# Altium schematic sheet ftdi232h.SchDoc: USB Interface
size A; Organization: UCLA HEP; DocumentNumber: 6; Revision: 2.0; SheetNumber: 6; SheetTotal: 14
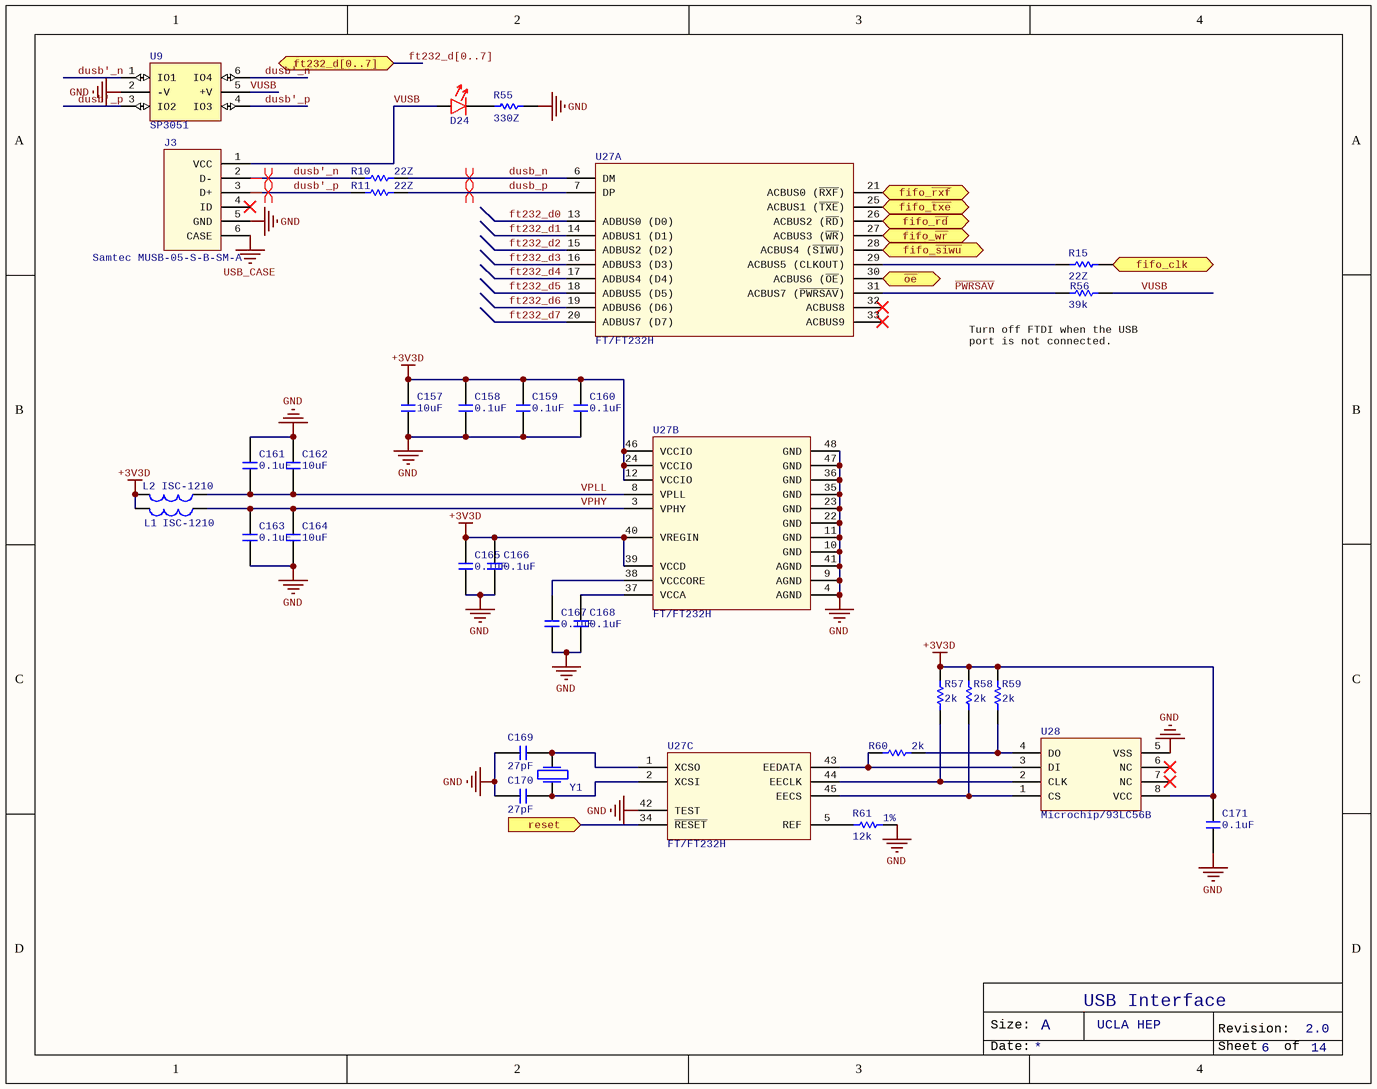
[diagram p0: ftdi232h.SchDoc]

## Parts
C157  10uF  [c1206]
C158  0.1uF  [C0402]
C159  0.1uF  [C0402]
C160  0.1uF  [C0402]
C161  0.1uF  [C0402]
C162  10uF  [c1206]
C163  0.1uF  [C0402]
C164  10uF  [c1206]
C165  0.1uF  [C0402]
C166  0.1uF  [C0402]
C167  0.1uF  [C0402]
C168  0.1uF  [C0402]
C169  27pF  [C0402]
C170  27pF  [C0402]
C171  0.1uF  [C0402]
D24  LITEON/LTST-C171KRKT  [LED0805]  (value not drawn)
J3  Samtec MUSB-05-S-B-SM-A  [MUSB-05-S-B-SM-A]
L1  ISC-1210  [ISC-1210]
L2  ISC-1210  [ISC-1210]
R10  22Z  [R0402]
R11  22Z  [R0402]
R15  22Z  [R0603]
R55  330Z  [R0603]
R56  39k  [R0603]
R57  2k  [R0603]
R58  2k  [R0603]
R59  2k  [R0603]
R60  2k  [R0603]
R61  12k  [R0603]
U9  SP3051  [SOT23-6]
U27  FT/FT232H  [LQFP-48]  (parts A,B,C of 3)
U28  Microchip/93LC56B  [SOIC-8]
Y1  XTAL  [XTAL]  (value not drawn)

## Ports
fifo_clk (in), fifo_~{rd} (in), fifo_~{rxf} (out), fifo_~{siwu} (in), fifo_~{txe} (out), fifo_~{wr} (in), ft232_d[0..7] (bidir), reset (in), ~{oe} (in)

## Nets
+3V3D: C157.2 C158.2 C159.2 C160.2 C165.2 C166.2 C171.2 L1.1 L2.1 R57.2 R58.2 R59.2 U27.12(VCCIO) U27.24(VCCIO) U27.39(VCCD) U27.40(VREGIN) U27.46(VCCIO) U28.8(VCC)
GND: C157.1 C158.1 C159.1 C160.1 C161.2 C162.2 C163.1 C164.2 C165.1 C166.1 C167.1 C168.1 C169.2 C170.2 C171.1 J3.5(GND) R55.1 R61.2 U9.2(-V) U27.4(AGND) U27.9(AGND) U27.10(GND) U27.11(GND) U27.22(GND) U27.23(GND) U27.35(GND) U27.36(GND) U27.41(AGND) U27.42(TEST) U27.47(GND) U27.48(GND) U28.5(VSS)
USB_CASE: J3.6(CASE)
dusb'_n: J3.2(D-) R10.1 U9.1(IO1) U9.6(IO4)
dusb'_p: J3.3(D+) R11.1 U9.3(IO2) U9.4(IO3)
dusb_n: R10.2 U27.6(DM)
dusb_p: R11.2 U27.7(DP)
fifo_clk: R15.2 ; port fifo_clk
fifo_~{rd}: U27.26(ACBUS2_(~{RD})) ; port fifo_~{rd}
fifo_~{rxf}: U27.21(ACBUS0_(~{RXF})) ; port fifo_~{rxf}
fifo_~{siwu}: U27.28(ACBUS4_(~{SIWU})) ; port fifo_~{siwu}
fifo_~{txe}: U27.25(ACBUS1_(~{TXE})) ; port fifo_~{txe}
fifo_~{wr}: U27.27(ACBUS3_(~{WR})) ; port fifo_~{wr}
ft232_d0: U27.13(ADBUS0_(D0))
ft232_d1: U27.14(ADBUS1_(D1))
ft232_d2: U27.15(ADBUS2_(D2))
ft232_d3: U27.16(ADBUS3_(D3))
ft232_d4: U27.17(ADBUS4_(D4))
ft232_d5: U27.18(ADBUS5_(D5))
ft232_d6: U27.19(ADBUS6_(D6))
ft232_d7: U27.20(ADBUS7_(D7))
~{oe}: U27.30(ACBUS6_(~{OE})) ; port ~{oe}
~{PWRSAV}: R56.1 U27.31(ACBUS7_(~{PWRSAV}))
reset: U27.34(~{RESET}) ; port reset
VPHY: C163.2 C164.1 L1.2 U27.3(VPHY)
VPLL: C161.1 C162.1 L2.2 U27.8(VPLL)
VUSB: D24.A J3.1(VCC) R56.2 U9.5(+V)
NetC167_2: C167.2 U27.38(VCCCORE)
NetC168_2: C168.2 U27.37(VCCA)
NetC169_1: C169.1 U27.1(XCSO) Y1.2
NetC170_1: C170.1 U27.2(XCSI) Y1.1
NetD24_C: D24.C R55.2
NetR15_1: R15.1 U27.29(ACBUS5_(CLKOUT))
NetR57_1: R57.1 U27.44(EECLK) U28.2(CLK)
NetR58_1: R58.1 U27.45(EECS) U28.1(CS)
NetR59_1: R59.1 R60.2 U28.4(DO)
NetR60_1: R60.1 U27.43(EEDATA) U28.3(DI)
NetR61_1: R61.1 U27.5(REF)

Not connected (* = marked no-connect by the designer): J3 4(ID)*; U27 32(ACBUS8)* 33(ACBUS9)*; U28 6(NC)* 7(NC)*

## Buses and harness runs
bus ft232_d[0..7] = port ft232_d[0..7]

## Layout directives
differential pair: dusb'_n, dusb'_p, dusb_n, dusb_p

## Notes on the sheet
- (near R56) Turn off FTDI when the USB port is not connected.
- (near R61) 1%
- Size:
- A
- Revision:
- Date:
- Sheet
- of

## Library data of the parts
C157 C162 C164 = CAP/GMK316F106ZL-T: CAP2, CER, 10uF, 10%, 35V, 1206; Manufacturer: Taiyo Yuden; Capacitance: 10µF; Tolerance: -20%, +80%; Temperature Coefficient: Y5V (F); Supplier 1: Digi-Key; Supplier Part Number 1: 587-1352-1-ND; Manufacturer Part Number: GMK316F106ZL-T; RoHS: RoHS Compliant; Category: Capacitors; Stock 1: 249989; Pricing 1: 1=0.46, 10=0.345, 50=0.2012, 100=0.161, 250=0.115, 500=0.0782, 1000=0.06325 (USD); Packaging: Cut Tape (CT); Voltage - Rated: 35V; Mounting Type: Surface Mount, MLCC; Operating Temperature: -30°C ~ 85°C; Applications: General Purpose; Ratings: -; Package / Case: 1206 (3216 Metric); Size / Dimension: 0.126" L x 0.063" W (3.20mm x 1.60mm); Height - Seated (Max): -; Thickness (Max): 0.071" (1.80mm); Lead Spacing: -; Features: -; Lead Style: -; ComponentLink1URL: http://ds.yuden.co.jp/TYCOMPAS/ut/detail.do?productNo=GMK316F106ZL-T&fileName=GMK316F106ZL-T_SS&mode=specSheetDownload; ComponentLink1Description: http://ds.yuden.co.jp/TYCOMPAS/ut/detail.do?productNo=GMK316F106ZL-T&fileName=GMK316F106ZL-T_SS&mode=specSheetDownload
C158-C161 C163 C165-C168 C171 = CAP/GRM155R61E104KA87D: CAP2, CER, 0.1uF, 10%, 25V, 0402, X5R; Manufacturer: Murata Electronics North America; Capacitance: 0.10µF; Supplier 1: Digi-Key; Manufacturer Part Number: GRM155R61E104KA87D; RoHS: RoHS Compliant; Category: Capacitors; Stock 1: 1672685; Pricing 1: 1=0.1, 10=0.022, 50=0.012, 100=0.0101, 250=0.00828, 500=0.00708, 1000=0.00552, 5000=0.0046 (USD); Packaging: Cut Tape (CT); Tolerance: ±10%; Voltage - Rated: 25V; Temperature Coefficient: X5R; Mounting Type: Surface Mount, MLCC; Operating Temperature: -55°C ~ 85°C; Applications: General Purpose; Ratings: -; Package / Case: 0402 (1005 Metric); Size / Dimension: 0.039" L x 0.020" W (1.00mm x 0.50mm); Height - Seated (Max): -; Thickness (Max): 0.022" (0.55mm); Lead Spacing: -; Features: -; Lead Style: -; ComponentLink1URL: http://www.murata.com/~/media/webrenewal/support/library/catalog/products/capacitor/mlcc/c02e.pdf; ComponentLink1Description: http://www.murata.com/~/media/webrenewal/support/library/catalog/products/capacitor/mlcc/c02e.pdf; Supplier Part Number 1: 490-5920-1-ND
C169 C170 = CAP CER 27PF 50V 1% NP0 0402: Manufacturer: Kemet; Manufacturer Part Number: C0402C270F5GACTU; Tolerance: ±1%; Voltage - Rated: 50V; Temperature Coefficient: C0G, NP0; Supplier 1: Digi-Key; Supplier Part Number 1: 399-11120-1-ND; RoHS: RoHS Compliant; Category: Capacitors; Stock 1: 25371; Pricing 1: 1=1.41, 10=1.175, 25=1.012, 50=0.9496, 100=0.7497, 250=0.62476, 1000=0.50225, 2500=0.45938, 5000=0.43488 (USD); Packaging: Cut Tape (CT); Capacitance: 27pF; Mounting Type: Surface Mount, MLCC; Operating Temperature: -55°C ~ 125°C; Applications: General Purpose; Ratings: -; Package / Case: 0402 (1005 Metric); Size / Dimension: 0.039" L x 0.020" W (1.00mm x 0.50mm); Height - Seated (Max): -; Thickness (Max): 0.022" (0.55mm); Lead Spacing: -; Features: -; Lead Style: -; ComponentLink1URL: http://www.kemet.com/docfinder?Partnumber=C0402C270F5GACTU; ComponentLink1Description: http://www.kemet.com/docfinder?Partnumber=C0402C270F5GACTU
D24 = LITEON/LTST-C171KRKT: LED, 20mA, 0805, Red; Supplier 1: Digi-Key; Supplier Part Number 1: 160-1427-1-ND
J3 = Samtec/MUSB-05-S-B-SM-A: USB, Mini-USB, SMD; Manufacturer: Samtec Inc.; Connector Type: USB - mini B; Number of Contacts: 5; Gender: Receptacle; Specifications: USB 2.0; Supplier 1: Digi-Key; Manufacturer Part Number: MUSB-05-S-B-SM-A; RoHS: RoHS Compliant; Stock 1: 1209; Pricing 1: 1=1.48, 10=1.222, 50=1.018, 100=0.9162, 250=0.84496, 500=0.7635, 1000=0.67697, 2500=0.64898, 5000=0.63625 (USD); ComponentLink1URL: http://suddendocs.samtec.com/prints/musb-05-x-b-sm-a-x-xx-mkt.pdf; ComponentLink1Description: http://suddendocs.samtec.com/prints/musb-05-x-b-sm-a-x-xx-mkt.pdf; Supplier Part Number 1: SAM8841-ND; Category: Connectors, Interconnects; Packaging: Tray; Mounting Type: Surface Mount, Right Angle, Horizontal; Features: Board Guide, Solder Retention; Ingress Protection: -
L1 L2 = ISC-1210: IND, 86uF, 90mA; Supplier 1: Digi-Key; Supplier Part Number 1: 541-1604-1-ND
R10 R11 = RES/ 311-22.0LRCT-ND: RES0, SMD, 22.0Z, 1.0%, 1/16W, 0402; Manufacturer: Yageo; Manufacturer Part Number: RC0402FR-0722RL; Resistance (Ohms): 22; Tolerance: ±1%; Power (Watts): 0.063W, 1/16W; Temperature Coefficient: ±100ppm/°C; Supplier 1: Digi-Key; RoHS: RoHS Compliant; Category: Resistors; Stock 1: 1724839; Pricing 1: 1=0.1, 10=0.013, 25=0.0096, 100=0.0054, 250=0.00412, 500=0.00328, 1000=0.00242, 2500=0.0021, 5000=0.00173 (USD); Packaging: Cut Tape (CT); Composition: Thick Film; Features: Moisture Resistant; Operating Temperature: -55°C ~ 155°C; Package / Case: 0402 (1005 Metric); Supplier Device Package: 0402; Size / Dimension: 0.039" L x 0.020" W (1.00mm x 0.50mm); Height: 0.016" (0.40mm); Number of Terminations: 2; ComponentLink1URL: http://www.yageo.com/documents/recent/PYu-RC_Group_51_RoHS_L_04.pdf; ComponentLink1Description: http://www.yageo.com/documents/recent/PYu-RC_Group_51_RoHS_L_04.pdf; Supplier Part Number 1: 311-22.0LRCT-ND; Supplier 2: Newark; Supplier Part Number 2: 67R9912
R15 = CRCW060322R0FKEA: RES0, SMD, 22.0Z, 1.0%, 1/10W, 0603; Manufacturer: Rohm Semiconductor; Manufacturer Part Number: MCR03ERTF22R0; Resistance (Ohms): 22; Tolerance: ±1%; Power (Watts): 0.1W, 1/10W; Temperature Coefficient: ±100ppm/°C; Supplier 1: Digi-Key; RoHS: RoHS Compliant; Category: Resistors; Packaging: Cut Tape (CT); Composition: Thick Film; Features: -; Operating Temperature: -55°C ~ 155°C; Package / Case: 0603 (1608 Metric); Supplier Device Package: 0603 (1608 Metric); Size / Dimension: 0.063" L x 0.031" W (1.60mm x 0.80mm); Height: 0.022" (0.55mm); Number of Terminations: 2; ComponentLink1URL: http://rohmfs.rohm.com/en/products/databook/datasheet/passive/resistor/chip_resistor/mcr_g.pdf; ComponentLink1Description: http://rohmfs.rohm.com/en/products/databook/datasheet/passive/resistor/chip_resistor/mcr_g.pdf; Stock 1: 6281; Pricing 1: 1=0.1, 10=0.011, 25=0.0084, 100=0.0047, 250=0.00356, 500=0.00286, 1000=0.0021 (USD); Supplier Part Number 1: RHM22.0CFCT-ND
R55 = CRCW0603330RFKEA: RES0, SMD,  330Z, 1.0%, 1/10W, 0603; Manufacturer: Rohm Semiconductor; Manufacturer Part Number: MCR03ERTF3300; Resistance (Ohms): 330; Tolerance: ±1%; Power (Watts): 0.1W, 1/10W; Temperature Coefficient: ±100ppm/°C; Supplier 1: Digi-Key; RoHS: RoHS Compliant; Category: Resistors; Stock 1: 139947; Pricing 1: 1=0.1, 10=0.011, 25=0.0084, 100=0.0047, 250=0.00356, 500=0.00286, 1000=0.0021 (USD); Packaging: Cut Tape (CT); Composition: Thick Film; Features: -; Operating Temperature: -55°C ~ 155°C; Package / Case: 0603 (1608 Metric); Supplier Device Package: 0603 (1608 Metric); Size / Dimension: 0.063" L x 0.031" W (1.60mm x 0.80mm); Height: 0.022" (0.55mm); Number of Terminations: 2; ComponentLink1URL: http://rohmfs.rohm.com/en/products/databook/datasheet/passive/resistor/chip_resistor/mcr_g.pdf; ComponentLink1Description: http://rohmfs.rohm.com/en/products/databook/datasheet/passive/resistor/chip_resistor/mcr_g.pdf; Supplier Part Number 1: RHM330CFCT-ND
R56 = CRCW060339K0FKEA: RES1, SMD, 39.0k, 1.0%, 1/10W, 0603
R57-R60 = CRCW06032K00FKEA: RES1, SMD, 2.00k, 1.0%, 1/10W, 0603
R61 = CRCW060312K0FKEA: RES1, SMD, 12.0k, 1.0%, 1/10W, 0603
U9 = Littelfuse/SP3051-04HTG: TVS, 6VWM, 16VC; Manufacturer: Littelfuse Inc.; Bidirectional Channels: 4; Voltage - Reverse Standoff (Typ): 6V (Max); Voltage - Breakdown (Min): 8V (Typ); Voltage - Clamping (Max) @ Ipp: 17V; Current - Peak Pulse (10/1000µs): 20A (8/20µs); Power - Peak Pulse: 400W; Power Line Protection: Yes; Supplier 1: Digi-Key; Manufacturer Part Number: SP3051-04HTG; RoHS: RoHS Compliant; Category: Circuit Protection; Stock 1: 7453; Pricing 1: 1=1.05, 10=0.925, 25=0.8352, 100=0.7308, 250=0.64092, 500=0.5684, 1000=0.4495 (USD); Packaging: Cut Tape (CT); Type: Steering (Rail to Rail); Unidirectional Channels: -; Applications: Ethernet; Capacitance @ Frequency: -; Operating Temperature: -40°C ~ 125°C (TJ); Mounting Type: Surface Mount; Package / Case: SOT-23-6; Supplier Device Package: SOT-23-6; ComponentLink1URL: http://www.littelfuse.com/~/media/electronics/datasheets/tvs_diode_arrays/littelfuse_tvs_diode_array_sp3051_datasheet.pdf.pdf; ComponentLink1Description: http://www.littelfuse.com/~/media/electronics/datasheets/tvs_diode_arrays/littelfuse_tvs_diode_array_sp3051_datasheet.pdf.pdf; Supplier 2: Newark; Supplier Part Number 1: F6279CT-ND; Supplier Part Number 2: 88W3903
U27 = FT/FT232H: FTDI 232H USB-UART; Supplier 1: Digi-Key; Supplier Part Number 1: 768-1101-1-ND
U28 = Microchip/93LC56B: EEPROM, 2Kb, 16-bitwidth; Manufacturer: Microchip Technology; Manufacturer Part Number: 93LC56B-I/SN; Format - Memory: EEPROMs - Serial; Memory Size: 2K (128 x 16); Speed: 2MHz; Interface: Microwire, 3-Wire Serial; Voltage - Supply: 2.5 V ~ 5.5 V; Supplier 1: Digi-Key; Supplier Part Number 1: 93LC56B-I/SN-ND; RoHS: RoHS Compliant; Category: Integrated Circuits (ICs); Stock 1: 7331; Pricing 1: 1=0.29, 10=0.245, 25=0.2348, 100=0.2244 (USD); Packaging: Tube; Memory Type: EEPROM; Operating Temperature: -40°C ~ 85°C; Package / Case: 8-SOIC (0.154", 3.90mm Width); Supplier Device Package: 8-SOIC N; ComponentLink1URL: http://www.microchip.com/mymicrochip/filehandler.aspx?ddocname=en013939; ComponentLink1Description: http://www.microchip.com/mymicrochip/filehandler.aspx?ddocname=en013939
Y1 = XTAL: XT9S20ANA16M; Manufacturer: VISHAY DALE; Supplier 1: Newark; Manufacturer Part Number: XT9S20ANA16M; RoHS: YES; Stock 1: 623; Pricing 1: 1=0.31, 250=0.31, 500=0.31, 1000=0.266, 5000=0.248 (USD); ComponentLink1URL: http://www.vishay.com/docs/35014/xt49s.pdf; ComponentLink1Description: http://www.vishay.com/docs/35014/xt49s.pdf; Supplier Part Number 1: 18C1481